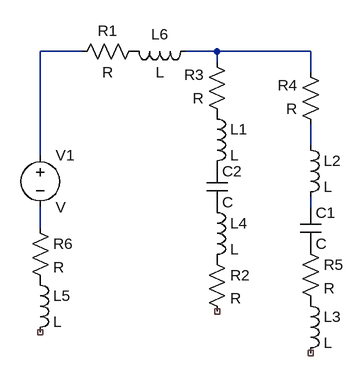
[diagram p0: schematic Draft2.asc]
Draft2.asc, the LTspice schematic file:
Version 4
SHEET 1 880 680
WIRE 112 -16 48 -16
WIRE 320 -16 272 -16
WIRE 464 -16 320 -16
WIRE 320 0 320 -16
WIRE 464 16 464 -16
WIRE 464 128 464 96
WIRE 48 144 48 -16
WIRE 464 224 464 208
WIRE 48 256 48 224
SYMBOL voltage 48 128 R0
SYMATTR InstName V1
SYMBOL res 208 -32 R90
WINDOW 0 0 56 VBottom 2
WINDOW 3 32 56 VTop 2
SYMATTR InstName R1
SYMBOL res 336 96 R180
WINDOW 0 36 76 Left 2
WINDOW 3 36 40 Left 2
SYMATTR InstName R3
SYMBOL res 480 112 R180
WINDOW 0 36 76 Left 2
WINDOW 3 36 40 Left 2
SYMATTR InstName R4
SYMBOL ind 448 112 R0
SYMATTR InstName L2
SYMBOL cap 448 224 R0
SYMATTR InstName C1
SYMBOL res 448 272 R0
SYMATTR InstName R5
SYMBOL ind 448 352 R0
SYMATTR InstName L3
SYMBOL ind 304 64 R0
SYMATTR InstName L1
SYMBOL cap 304 160 R0
SYMATTR InstName C2
SYMBOL ind 304 208 R0
SYMATTR InstName L4
SYMBOL res 304 288 R0
SYMATTR InstName R2
SYMBOL res 32 240 R0
SYMATTR InstName R6
SYMBOL ind 32 320 R0
SYMATTR InstName L5
SYMBOL ind 288 -32 R90
WINDOW 0 5 56 VBottom 2
WINDOW 3 32 56 VTop 2
SYMATTR InstName L6

The netlist it stands for:
* Draft2.asc
V1 N001 N005 V
R1 P001 N001 R
R3 P002 N002 R
R4 N003 N002 R
L2 N003 N004 L
C1 N004 P003 C
R5 P003 P004 R
L3 P004 NC_01 L
L1 P002 P005 L
C2 P005 P006 C
L4 P006 P007 L
R2 P007 NC_02 R
R6 N005 P008 R
L5 P008 NC_03 L
L6 N002 P001 L
.backanno
.end